# Altium schematic sheet PL2303.SchDoc
size A4
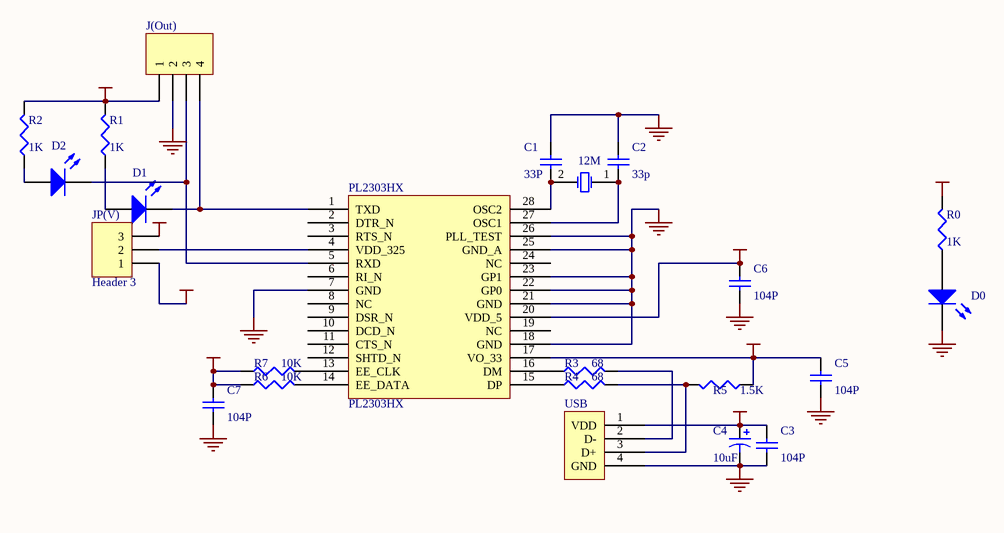
[diagram p0: PL2303.SchDoc]

## Parts
12M  XTAL  [RAD-0.2]  (value not drawn)
C1  value 33P  [CR2012-0805]  (hidden comment: Cap)
C2  value 33p  [CR2012-0805]  (hidden comment: Cap)
C3  value 104P  [CR2012-0805]  (hidden comment: Cap)
C4  value 10uF  [CR3225-1210]  (hidden comment: Cap Pol2)
C5  value 104P  [CR2012-0805]  (hidden comment: Cap)
C6  value 104P  [CR2012-0805]  (hidden comment: Cap)
C7  value 104P  [CR2012-0805]  (hidden comment: Cap)
D0  LED2  [R2012-0805]  (value not drawn)
D1  LED2  [R2012-0805]  (value not drawn)
D2  LED2  [R2012-0805]  (value not drawn)
J(Out)  Header 4  [HDR1X4]  (value not drawn)
JP(V)  Header 3  [HDR1X3]
PL2303HX  PL2303HX  [SSOP28]
R0  value 1K  [R2012-0805]  (hidden comment: Res3)
R1  value 1K  [R2012-0805]  (hidden comment: Res3)
R2  value 1K  [R2012-0805]  (hidden comment: Res3)
R3  value 68  [CR2012-0805]  (hidden comment: Res3)
R4  value 68  [CR2012-0805]  (hidden comment: Res3)
R5  value 1.5K  [CR2012-0805]  (hidden comment: Res3)
R6  value 10K  [CR2012-0805]  (hidden comment: Res3)
R7  value 10K  [CR2012-0805]  (hidden comment: Res3)
USB  USB  [mini_USB]  (value not drawn)

## Nets
GND: C1.2 C2.2 C3.1 C4.2 C5.1 C6.1 C7.1 D0.2(K) J(Out).2 PL2303HX.7(GND) PL2303HX.18(GND) PL2303HX.21(GND) PL2303HX.22(GP0) PL2303HX.23(GP1) PL2303HX.25(GND_A) PL2303HX.26(PLL_TEST) USB.4(GND)
VDD: C3.2 C4.1 C6.2 C7.2 J(Out).1 JP(V).3 PL2303HX.20(VDD_5) R0.2 R1.2 R2.2 R6.1 R7.1 USB.1(VDD)
VDD3.3: C5.2 JP(V).1 PL2303HX.17(VO_33) R5.1
Net12M_1: 12M.1(OSC1) C2.1 PL2303HX.27(OSC1)
Net12M_2: 12M.2(OSC2) C1.1 PL2303HX.28(OSC2)
NetD0_1: D0.1(A) R0.1
NetD1_1: D1.1(A) R1.1
NetD1_2: D1.2(K) J(Out).4 PL2303HX.1(TXD)
NetD2_1: D2.1(A) R2.1
NetD2_2: D2.2(K) J(Out).3 PL2303HX.5(RXD)
NetJP(V)_2: JP(V).2 PL2303HX.4(VDD_325)
NetPL2303HX_13: PL2303HX.13(EE_CLK) R7.2
NetPL2303HX_14: PL2303HX.14(EE_DATA) R6.2
NetPL2303HX_15: PL2303HX.15(DP) R4.1
NetPL2303HX_16: PL2303HX.16(DM) R3.1
NetR3_2: R3.2 USB.2(D-)
NetR4_2: R4.2 R5.2 USB.3(D+)

Not connected (* = marked no-connect by the designer): PL2303HX 2(DTR_N) 3(RTS_N) 6(RI_N) 8(NC) 9(DSR_N) 10(DCD_N) 11(CTS_N) 12(SHTD_N) 19(NC) 24(NC)

## Library data of the parts
12M = XTAL: Crystal Oscillator; Published: 8-Jun-2000; Revision: July-2002: Re-released for DXP Platform.; Publisher: Altium Limited
C1-C3 C5-C7 = Cap: Capacitor; Published: 8-Jun-2000; Revision: July-2002: Re-released for DXP Platform.; Publisher: Altium Limited
C4 = Cap Pol2: Polarized Capacitor (Axial); Published: 8-Jun-2000; Revision: July-2002: Re-released for DXP Platform.; Publisher: Altium Limited
D0-D2 = LED2: Typical RED, GREEN, YELLOW, AMBER GaAs LED; Published: 8-Jun-2000; Revision: July-2002: Re-released for DXP Platform.; Publisher: Altium Limited
J(Out) = Header 4: Header, 4-Pin; Revision: 17-Jul-2002: Re-released for DXP Platform.; Publisher: Altium Limited
JP(V) = Header 3: Header, 3-Pin; Revision: 17-Jul-2002: Re-released for DXP Platform.; Publisher: Altium Limited
PL2303HX = PL2303
R0-R7 = Res3: Resistor; Published: 8-Jun-2000; Revision: July-2002: Re-released for DXP Platform.; Publisher: Altium Limited